# Altium schematic sheet BeaglePhone_Rev1_SCH.SchDoc: Complete Schematic
size 508 x 381 mm; Date: Not shown in title block; ApprovedBy: Not shown in title block; CheckedBy: Not shown in title block; Author: Not shown in title block; CompanyName: Not shown in title block; DrawnBy: Not shown in title block; Engineer: Not shown in title block; Organization: Not shown in title block; Address1: Not shown in title block; Address2: Not shown in title block; Address3: Not shown in title block; Address4: Not shown in title block; DocumentNumber: 1; Revision: Use project parameter SCH_Rev; SheetNumber: 1; SheetTotal: 1; PageSetup: Record=PageOptions|CenterHorizontal=True|CenterVertical=True|PrintScale=0.72|XCorrection=1.00|YCorrection=1.00|PrintKind=0|BorderSize=5000000|LeftOffset=0|BottomOffset=0|Orientation=2|PaperLength=1000|PaperWidth=1000|Scale=100|PaperSource=15|PrintQuality=600|MediaType=1|DitherType=10|PaperKind=Letter|PrintScaleMode=1; CurrentTime: Not shown in title block; CurrentDate: Not shown in title block; Time: Not shown in title block; DocumentFullPathAndName: Not shown in title block; DocumentName: Not shown in title block; ModifiedDate: Not shown in title block; ImagePath: Not shown in title block
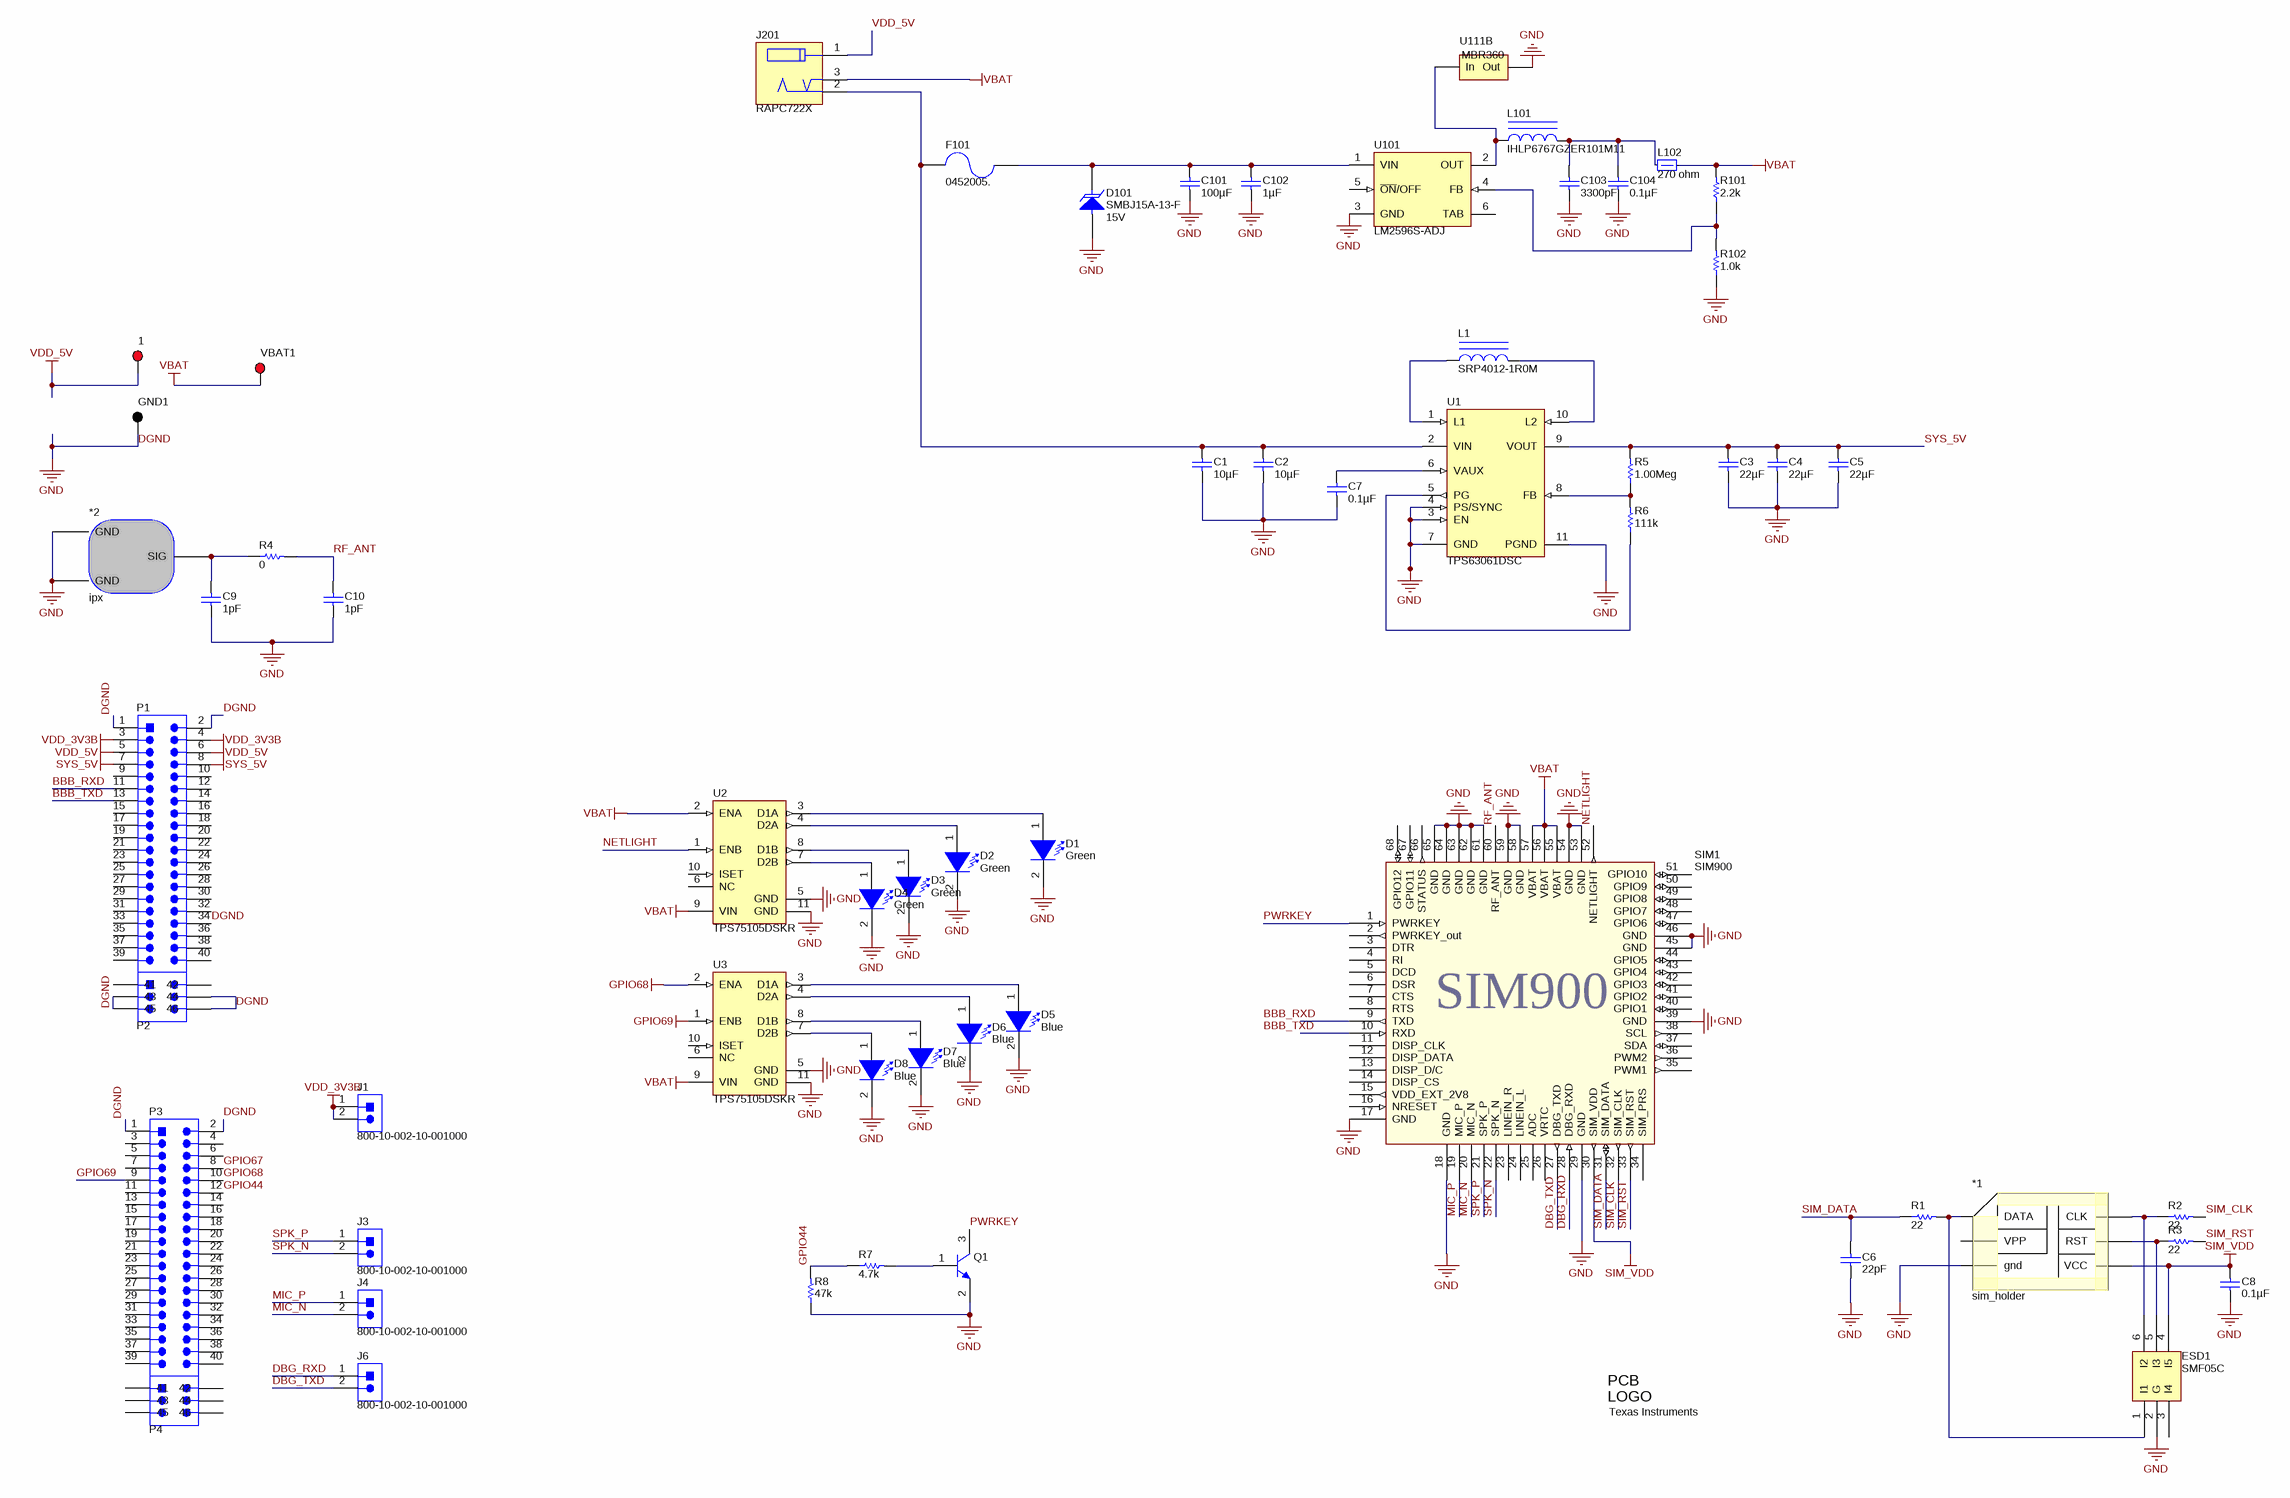
[diagram p0: BeaglePhone_Rev1_SCH.SchDoc]

## Parts
1  5005  [Keystone5005]  (value not drawn)
*1  sim_holder  [SIM_socket]
*2  ipx  [IPX_U.FL]
C1  ValueDisplayed: 10µF  [0603]  (hidden comment: C1608X5R1A106M)
C2  ValueDisplayed: 10µF  [0603]  (hidden comment: C1608X5R1A106M)
C3  ValueDisplayed: 22µF  [0603]  (hidden comment: C1608X5R0G226M080AA)
C4  ValueDisplayed: 22µF  [0603]  (hidden comment: C1608X5R0G226M080AA)
C5  ValueDisplayed: 22µF  [0603]  (hidden comment: C1608X5R0G226M080AA)
C6  ValueDisplayed: 22pF  [0603]  (hidden comment: GRM1885C2A220JA01D)
C7  ValueDisplayed: 0.1µF  [0603]  (hidden comment: C0603X104K3RACTU)
C8  ValueDisplayed: 0.1µF  [0603]  (hidden comment: 06035C104KAT2A)
C9  ValueDisplayed: 1pF  [0603]  (hidden comment: C0603C109C5GACTU)
C10  ValueDisplayed: 1pF  [0603]  (hidden comment: C0603C109C5GACTU)
C101  ValueDisplayed: 100µF  [1206]  (hidden comment: GRM31CR60J107ME39L)
C102  ValueDisplayed: 1µF  [0603]  (hidden comment: GRM188R61A105KA61D)
C103  ValueDisplayed: 3300pF  [0603]  (hidden comment: GRM188R71H332KA01D)
C104  ValueDisplayed: 0.1µF  [0603]  (hidden comment: C0603X104K4RACTU)
D1  value Green  [LG L29K_GREEN]  (hidden comment: LG L29K-G2J1-24-Z)
D2  value Green  [LG L29K_GREEN]  (hidden comment: LG L29K-G2J1-24-Z)
D3  value Green  [LG L29K_GREEN]  (hidden comment: LG L29K-G2J1-24-Z)
D4  value Green  [LG L29K_GREEN]  (hidden comment: LG L29K-G2J1-24-Z)
D5  value Blue  [LB Q39G_BLUE]  (hidden comment: LB Q39G-L2N2-35-1)
D6  value Blue  [LB Q39G_BLUE]  (hidden comment: LB Q39G-L2N2-35-1)
D7  value Blue  [LB Q39G_BLUE]  (hidden comment: LB Q39G-L2N2-35-1)
D8  value Blue  [LB Q39G_BLUE]  (hidden comment: LB Q39G-L2N2-35-1)
D101  SMBJ15A-13-F  value 15V  [SMB]
ESD1  SMF05C  [6pin]
F101  0452005.  [SloBlo452]
GND1  5006  [Keystone5006]  (value not drawn)
J1  800-10-002-10-001000  [Mill-Max_800-10-002-10-001000]
J3  800-10-002-10-001000  [Mill-Max_800-10-002-10-001000]
J4  800-10-002-10-001000  [Mill-Max_800-10-002-10-001000]
J6  800-10-002-10-001000  [Mill-Max_800-10-002-10-001000]
J201  RAPC722X  [CONN_RAPC722X]
L1  SRP4012-1R0M  [SRP4012]
L101  IHLP6767GZER101M11  [IHLP-6767GZ-11]
L102  value 270 ohm  [2220]  (hidden comment: HI2220P271R-10)
Logo1  Texas Instruments  [TI_Symbol_Overlay_Small]  (no BOM)
P1  Comment  [TSW-120-07-G-D]  (value not drawn)
P2  Comment  [SULLINS_PEC03DAAN]  (value not drawn)
P3  Comment  [TSW-120-07-G-D]  (value not drawn)
P4  Comment  [SULLINS_PEC03DAAN]  (value not drawn)
Q1  MMBT2222LT1G  [SOT-23]  (value not drawn)
R1  value 22  [0603]  (hidden comment: CRCW060322R0JNEA)
R2  value 22  [0603]  (hidden comment: CRCW060322R0JNEA)
R3  value 22  [0603]  (hidden comment: CRCW060322R0JNEA)
R4  value 0  [0805_HV]  (hidden comment: CRCW08050000Z0EAHP)
R5  value 1.00Meg  [0603]  (hidden comment: CRCW06031M00FKEA)
R6  value 111k  [0603]  (hidden comment: RT0603BRD07111KL)
R7  ValueDisplayed: 4.7k  [0402]  (hidden comment: CRCW04024K70JNED)
R8  ValueDisplayed: 47k  [0402]  (hidden comment: CRCW04024K70JNED)
R101  value 2.2k  [0603]  (hidden comment: CRCW06032K20JNEA)
R102  value 1.0k  [0603]  (hidden comment: CRCW06031K00JNEA)
SIM1  SIM900  [PCBComponent_1 - duplicate1]
U1  TPS63061DSC  [DSC0010E]
U2  TPS75105DSKR  [DSK0010A]
U3  TPS75105DSKR  [DSK0010A]
U101  LM2596S-ADJ  [TS5B_N]
U111  Used in BOM report  [PCBComponent_1 - duplicate2]  (value not drawn)  (part B of 2)
VBAT1  5005  [Keystone5005]  (value not drawn)

## Nets
DGND: *1.1(gnd) *2.1(GND) *2.2(GND) C1.1 C2.1 C3.1 C4.1 C5.1 C6.2 C7.2 C8.2 C9.2 C10.2 C101.2 C102.2 C103.2 C104.2 D1.2(K) D2.2(K) D3.2(K) D4.2(K) D5.2(K) D6.2(K) D7.2(K) D8.2(K) D101.2(A) ESD1.2(G) GND1.1 P1.1 P1.2 P1.34 P2.3(43) P2.4(44) P2.5(45) P2.6(46) P3.1 P3.2 Q1.2(E) R8.1 R102.1 SIM1.17(GND) SIM1.18(GND) SIM1.29(GND) SIM1.39(GND) SIM1.45(GND) SIM1.46(GND) SIM1.53(GND) SIM1.54(GND) SIM1.58(GND) SIM1.59(GND) SIM1.61(GND) SIM1.62(GND) SIM1.63(GND) SIM1.64(GND) SIM1.65(GND) U1.3(EN) U1.4(PS/SYNC) U1.7(GND) U1.11(PGND) U2.5(GND) U2.11(GND) U3.5(GND) U3.11(GND) U101.3(GND) U111.2(Out)  [also labelled GND]
GPIO68: P3.10 U3.2(ENA)
GPIO69: P3.9 U3.1(ENB)
SIM_VDD: *1.6(VCC) C8.1 ESD1.4(I5) SIM1.30(SIM_VDD)
SYS_5V: C3.2 C4.2 C5.2 P1.7 P1.8 R5.2 U1.9(VOUT)
VBAT: J201.3 L102.2 R101.2 SIM1.55(VBAT) SIM1.56(VBAT) SIM1.57(VBAT) U2.2(ENA) U2.9(VIN) U3.9(VIN) VBAT1.1
VDD_3V3B: J1.1 J1.2 P1.3 P1.4
VDD_5V: 1.1 J201.1 P1.5 P1.6
BBB_RXD: P1.11
BBB_TXD: P1.13
DBG_RXD: J6.1 SIM1.28(DBG_RXD)
DBG_TXD: J6.2 SIM1.27(DBG_TXD)
GPIO44: P3.12 R7.1 R8.2
GPIO67: P3.8
MIC_N: J4.2 SIM1.20(MIC_N)
MIC_P: J4.1 SIM1.19(MIC_P)
NETLIGHT: SIM1.52(NETLIGHT) U2.1(ENB)
PWRKEY: Q1.3(C) SIM1.1(PWRKEY)
RF_ANT: C10.1 R4.2 SIM1.60(RF_ANT)
SIM_CLK: R2.2 SIM1.32(SIM_CLK)
SIM_DATA: C6.1 R1.1 SIM1.31(SIM_DATA)
SIM_RST: R3.2 SIM1.33(SIM_RST)
SPK_N: J3.2 SIM1.22(SPK_N)
SPK_P: J3.1 SIM1.21(SPK_P)
Net*1_3: *1.3(DATA) ESD1.1(I1) R1.2
Net*1_4: *1.4(CLK) ESD1.6(I2) R2.1
Net*1_5: *1.5(RST) ESD1.5(I3) R3.1
Net*2_3: *2.3(SIG) C9.1 R4.1
NetC1_2: C1.2 C2.2 F101.2 J201.2 U1.2(VIN)
NetC7_1: C7.1 U1.6(VAUX)
NetC101_1: C101.1 C102.1 D101.1(K) F101.1 U101.1(VIN)
NetC103_1: C103.1 C104.1 L101.2 L102.1
NetD1_1: D1.1(A) U2.3(D1A)
NetD2_1: D2.1(A) U2.4(D2A)
NetD3_1: D3.1(A) U2.8(D1B)
NetD4_1: D4.1(A) U2.7(D2B)
NetD5_1: D5.1(A) U3.3(D1A)
NetD6_1: D6.1(A) U3.4(D2A)
NetD7_1: D7.1(A) U3.8(D1B)
NetD8_1: D8.1(A) U3.7(D2B)
NetL1_1: L1.1 U1.1(L1)
NetL1_2: L1.2 U1.10(L2)
NetL101_1: L101.1 U101.2(OUT) U111.1(In)
NetQ1_1: Q1.1(B) R7.2
NetR5_1: R5.1 R6.2 U1.8(FB)
NetR6_1: R6.1 U1.5(PG)
NetR101_1: R101.1 R102.2 U101.4(FB)

Not connected (* = marked no-connect by the designer): *1 2(VPP); ESD1 3(I4); P1 9 10 12 14 15 16 17 18 19 20 21 22 23 24 25 26 27 28 29 30 31 32 33 35 36 37 38 39 40; P2 1(41) 2(42); P3 3 4 5 6 7 11 13 14 15 16 17 18 19 20 21 22 23 24 25 26 27 28 29 30 31 32 33 34 35 36 37 38 39 40; P4 1(41) 2(42) 3(43) 4(44) 5(45) 6(46); SIM1 2(PWRKEY_out) 3(DTR) 4(RI) 5(DCD) 6(DSR) 7(CTS) 8(RTS) 9(TXD) 10(RXD) 11(DISP_CLK) 12(DISP_DATA) 13(DISP_D/C) 14(DISP_CS) 15(VDD_EXT_2V8) 16(NRESET) 23(LINEIN_R) 24(LINEIN_L) 25(ADC) 26(VRTC) 34(SIM_PRS) 35(PWM1) 36(PWM2) 37(SDA) 38(SCL) 40(GPIO1) 41(GPIO2) 42(GPIO3) 43(GPIO4) 44(GPIO5) 47(GPIO6) 48(GPIO7) 49(GPIO8) 50(GPIO9) 51(GPIO10) 66(STATUS) 67(GPIO11) 68(GPIO12); U2 6(NC) 10(ISET); U3 6(NC) 10(ISET); U101 5(~{ON}/OFF) 6(TAB)

## Notes on the sheet
- Labels drawn without touching a wire or pin: BBB_RXD, BBB_TXD
- Project:
- Designed for:
- Mod. Date:
- Sheet Title:
- Size:
- File:
- Assembly Variant:
- B
- Schematic:
- 870
- Rev:
- Sheet:
- of
- http://www.ti.com
- Texas Instruments and/or its licensors do not warrant the accuracy or completeness of this specification or any information contained therein. Texas Instruments and/or its licensors do not warrant that this design will meet the specifications, will be suitable for your application or fit for any particular purpose, or will operate in an implementation. Texas Instruments and/or its licensors do not warrant that the design is production worthy. You should completely validate and test your design implementation to confirm the system functionality for your application.
- Contact:
- © Texas Instruments
- (in symbol TI_Logo) PCB; LOGO

## Library data of the parts
1 VBAT1 = 5005: Test Point, TH, Compact, Red; Manufacturer: Keystone; Alternate Manufacturer: Any; Alternate PartNumber: Equivalent; CompType: Test Point Loop; U/M: EA; RoHS: Y; DigiKeyPartNumber: 5005K-ND; Value: Red; SymbolVersion: 2008-04-04; PartNumber: 5005; PackageReference: Keystone5005; ComponentLink1Description: Datasheet Link; ComponentLink1URL: http://www.keyelco.com/pdfs/M55p51.pdf; MountType: TH; Publisher: Texas Instruments; LatestRevisionDate: 2012-07-13; LatestRevisionNote: Changed publisher; Supplier 1: Digi-Key; Supplier Part Number 1: 5005K-ND
C1 C2 = C1608X5R1A106M: CAP, CERM, 10uF, 10V, +/-20%, X5R, 0603; Manufacturer: TDK; Polarized: N; CompType: Capacitor; U/M: EA; Cap_F: 0.00001; Tolerance_%: 20; ESR_Ohm: 0.0078; Value1: 0.0078 ohm; VDC_V: 10; IRMS_A: 1.85; TaMin_C: -55; TaMax_C: 85; SymbolVersion: 2008-07-09; Value: 10uF; PartNumber: C1608X5R1A106M; PackageReference: 0603; RoHS: Y; Value2: 10V; MountType: SMT; Technology: Ceramic; TempCo: X5R; Cap_Case: 0603; Published: 2008-06-19; Publisher: Texas Instruments; LatestRevisionDate: 2014-05-28; ComponentLink1Description: Datasheet link; ComponentLink1URL: http://www.tdk.com/pdf/general_B11.pdf; Supplier 1: Digi-Key; Supplier Part Number 1: 445-6853-1-ND; Supplier 2: Farnell; Supplier Part Number 2: 1962113
C3-C5 = C1608X5R0G226M080AA: CAP, CERM, 22uF, 4V, +/-20%, X5R, 0603; Manufacturer: TDK; Polarized: N; CompType: Capacitor; U/M: EA; Cap_F: 0.000022; Tolerance_%: 20; Value1: Unknown; VDC_V: 4; TaMin_C: -55; TaMax_C: 85; SymbolVersion: 2008-07-09; Value: 22uF; PartNumber: C1608X5R0G226M080AA; PackageReference: 0603; RoHS: Y; Value2: 4V; MountType: SMT; Technology: Ceramic; TempCo: X5R; Cap_Case: 0603; Published: 2008-06-19; Publisher: Texas Instruments; LatestRevisionDate: 2014-05-28; ComponentLink1Description: Datasheet link; ComponentLink1URL: http://www.tdk.com/pdf/TDKMLCCCapRange.pdf; Supplier 1: Digi-Key; Supplier Part Number 1: 445-8030-1-ND
C6 = GRM1885C2A220JA01D: CAP, CERM, 22pF, 100V, +/-5%, C0G/NP0, 0603; Manufacturer: MuRata; Polarized: N; CompType: Capacitor; U/M: EA; Cap_F: 0.000000000022; Tolerance_%: 5; Value1: Unknown; VDC_V: 100; TaMin_C: -55; TaMax_C: 125; SymbolVersion: 2008-07-09; Value: 22pF; PartNumber: GRM1885C2A220JA01D; PackageReference: 0603; RoHS: Y; Value2: 100V; MountType: SMT; Technology: Ceramic; TempCo: C0G/NP0; Cap_Case: 0603; Published: 2008-06-19; Publisher: Texas Instruments; LatestRevisionDate: 2014-05-28; ComponentLink1Description: Datasheet link; ComponentLink1URL: http://search.murata.co.jp/Ceramy/PnsearchViewAction.do?HnOFG=ON&HnNFG=ON&SEL_CNT=50&sLang=en&sKey=GRM1885C2A220JA01D&x=9&y=9&search=startwith; Supplier 1: Digi-Key; Supplier Part Number 1: 490-1335-1-ND; Supplier 2: Mouser; Supplier Part Number 2: 81-GRM1885C2A220JA01
C7 = C0603X104K3RACTU: CAP, CERM, 0.1uF, 25V, +/-10%, X7R, 0603; Manufacturer: Kemet; Polarized: N; CompType: Capacitor; U/M: EA; Cap_F: 0.0000001; Tolerance_%: 10; Value1: Unknown; VDC_V: 25; TaMin_C: -55; TaMax_C: 125; SymbolVersion: 2008-07-09; Value: 0.1uF; PartNumber: C0603X104K3RACTU; PackageReference: 0603; RoHS: Y; Value2: 25V; MountType: SMT; Technology: Ceramic; TempCo: X7R; Cap_Case: 0603; Published: 2008-06-19; Publisher: Texas Instruments; LatestRevisionDate: 2014-05-28; ComponentLink1Description: Datasheet link; ComponentLink1URL: http://www.kemet.com/kemet/web/homepage/kechome.nsf/vapubfiles/F3102_Y5V.pdf/$file/F3102_Y5V.pdf; Supplier 1: Digi-Key; Supplier Part Number 1: 399-5345-1-ND; Supplier 2: Mouser; Supplier Part Number 2: 80-C0603X104K3R; Supplier 3: Farnell; Supplier Part Number 3: 1601773
C8 = 06035C104KAT2A: CAP, CERM, 0.1 µF, 50 V, +/- 10%, X7R, 0603; Manufacturer: AVX; Polarized: N; CompType: Capacitor; Value: 0.1uF; U/M: EA; Cap_F: 0.0000001; Tolerance_%: 10; Value1: Unknown; VDC_V: 50; Value2: 50V; TaMin_C: -55; TaMax_C: 125; SymbolVersion: 2008-07-09; PartNumber: 06035C104KAT2A; PackageReference: 0603; RoHS: Y; MountType: SMT; Technology: Ceramic; TempCo: X7R; Cap_Case: 0603; Published: 2008-06-19; Publisher: Texas Instruments; LatestRevisionDate: 2014-07-21; ComponentLink1Description: Datasheet link; ComponentLink1URL: http://www.avx.com/docs/Catalogs/cx7r.pdf; Supplier 1: Digi-Key; Supplier Part Number 1: 478-5052-1-ND; Supplier 2: Mouser; Supplier Part Number 2: 581-06035C104KAT2A; Supplier 3: Farnell; Supplier Part Number 3: 1301804
C9 C10 = C0603C109C5GACTU: CAP, CERM, 1pF, 50V, +/-25%, C0G/NP0, 0603; Manufacturer: Kemet; Polarized: N; CompType: Capacitor; U/M: EA; Cap_F: 0.000000000001; Tolerance_%: 25; Value1: Unknown; VDC_V: 50; TaMin_C: -55; TaMax_C: 125; SymbolVersion: 2008-07-09; Value: 1pF; PartNumber: C0603C109C5GACTU; PackageReference: 0603; RoHS: Y; Value2: 50V; MountType: SMT; Technology: Ceramic; TempCo: C0G/NP0; Cap_Case: 0603; Published: 2008-06-19; Publisher: Texas Instruments; LatestRevisionDate: 2014-05-28; ComponentLink1Description: Datasheet link; ComponentLink1URL: http://www.kemet.com/kemet/web/homepage/kechome.nsf/vapubfiles/F3102_Y5V.pdf/$file/F3102_Y5V.pdf; Supplier 1: Digi-Key; Supplier Part Number 1: 399-1045-1-ND; Supplier 2: Mouser; Supplier Part Number 2: 80-C0603C109C5G; Supplier 3: Farnell; Supplier Part Number 3: 1414611
C101 = GRM31CR60J107ME39L: CAP, CERM, 100uF, 6.3V, +/-20%, X5R, 1206; Manufacturer: MuRata; Polarized: N; CompType: Capacitor; U/M: EA; Cap_F: 0.0001; Tolerance_%: 20; ESR_Ohm: 0.003; Value1: 0.003 ohm; VDC_V: 6.3; TaMin_C: -55; TaMax_C: 85; SymbolVersion: 2008-07-09; Value: 100uF; PartNumber: GRM31CR60J107ME39L; PackageReference: 1206; RoHS: Y; Value2: 6.3V; MountType: SMT; Technology: Ceramic; TempCo: X5R; Cap_Case: 1206; Published: 2008-06-19; Publisher: Texas Instruments; LatestRevisionDate: 2014-05-28; ComponentLink1Description: Datasheet link; ComponentLink1URL: http://search.murata.co.jp/Ceramy/PnsearchViewAction.do?HnOFG=ON&HnNFG=ON&SEL_CNT=50&sLang=en&sKey=GRM31CR60J107ME39L&x=9&y=9&search=startwith; Supplier 1: Digi-Key; Supplier Part Number 1: 490-4539-1-ND; Supplier 2: Mouser; Supplier Part Number 2: 81-GRM31CR60J107ME9L; Supplier 3: Farnell; Supplier Part Number 3: 1735535
C102 = GRM188R61A105KA61D: CAP, CERM, 1uF, 10V, +/-10%, X5R, 0603; Manufacturer: MuRata; Polarized: N; CompType: Capacitor; U/M: EA; Cap_F: 0.000001; Tolerance_%: 10; Value1: Unknown; TaMin_C: -55; TaMax_C: 85; SymbolVersion: 2008-07-09; Value: 1uF; PartNumber: GRM188R61A105KA61D; PackageReference: 0603; RoHS: Y; VDC_V: 10; Value2: 10V; MountType: SMT; Technology: Ceramic; TempCo: X5R; Cap_Case: 0603; Published: 2008-06-19; Publisher: Texas Instruments; LatestRevisionDate: 2014-05-28; ComponentLink1Description: Datasheet link; ComponentLink1URL: http://search.murata.co.jp/Ceramy/PnsearchViewAction.do?HnOFG=ON&HnNFG=ON&SEL_CNT=50&sLang=en&sKey=GRM188R61A105KA61D&x=9&y=9&search=startwith; Supplier 1: Digi-Key; Supplier Part Number 1: 490-1543-1-ND; Supplier 2: Mouser; Supplier Part Number 2: 81-GRM39R105K10; Supplier 3: Farnell; Supplier Part Number 3: 1828798
C103 = GRM188R71H332KA01D: CAP, CERM, 3300pF, 50V, +/-10%, X7R, 0603; Manufacturer: MuRata; Polarized: N; CompType: Capacitor; U/M: EA; Cap_F: 0.0000000033; Tolerance_%: 10; Value1: Unknown; VDC_V: 50; TaMin_C: -55; TaMax_C: 125; SymbolVersion: 2008-07-09; Value: 3300pF; PartNumber: GRM188R71H332KA01D; PackageReference: 0603; RoHS: Y; Value2: 50V; MountType: SMT; Technology: Ceramic; TempCo: X7R; Cap_Case: 0603; Published: 2008-06-19; Publisher: Texas Instruments; LatestRevisionDate: 2014-05-28; ComponentLink1Description: Datasheet link; ComponentLink1URL: http://search.murata.co.jp/Ceramy/PnsearchViewAction.do?HnOFG=ON&HnNFG=ON&SEL_CNT=50&sLang=en&sKey=GRM188R71H332KA01D&x=9&y=9&search=startwith; Supplier 1: Digi-Key; Supplier Part Number 1: 490-1503-1-ND; Supplier 2: Mouser; Supplier Part Number 2: 81-GRM188R71H332KA; Supplier 3: Farnell; Supplier Part Number 3: 1828914
C104 = C0603X104K4RACTU: CAP, CERM, 0.1uF, 16V, +/-10%, X7R, 0603; Manufacturer: Kemet; Polarized: N; CompType: Capacitor; U/M: EA; Cap_F: 0.0000001; Tolerance_%: 10; Value1: Unknown; VDC_V: 16; TaMin_C: -55; TaMax_C: 125; SymbolVersion: 2008-07-09; Value: 0.1uF; PartNumber: C0603X104K4RACTU; PackageReference: 0603; RoHS: Y; Value2: 16V; MountType: SMT; Technology: Ceramic; TempCo: X7R; Cap_Case: 0603; Published: 2008-06-19; Publisher: Texas Instruments; LatestRevisionDate: 2014-05-28; ComponentLink1Description: Datasheet link; ComponentLink1URL: http://www.kemet.com/kemet/web/homepage/kechome.nsf/vapubfiles/F3102_Y5V.pdf/$file/F3102_Y5V.pdf; Supplier 1: Digi-Key; Supplier Part Number 1: 399-5344-1-ND; Supplier 2: Mouser; Supplier Part Number 2: 80-C0603X104K4R; Supplier 3: Farnell; Supplier Part Number 3: 1414027
D1-D4 = LG L29K-G2J1-24-Z: LED, Green, SMD; Manufacturer: OSRAM; Vf_V: 1.7; Value2: 1.7V; Io_A: 0.002; Tjmax_C: 110; Value1: W; U/M: EA; CompType: LED; PartNumber: LG L29K-G2J1-24-Z; SymbolVersion: 2008-12-08; MountType: SMT; RoHS: Y; PackageReference: 1.7x0.65x0.8mm; Type: ?; Color: green; Published: 2008-07-11; Publisher: Texas Instruments; ComponentLink1URL: http://www.osram-os.com/Graphics/XPic2/00077107_0.pdf; ComponentLink1Description: Datasheet link; LatestRevisionDate: 2014-05-14; Supplier 1: Digi-Key; Supplier Part Number 1: 475-2709-1-ND; Supplier 2: Mouser; Supplier Part Number 2: 720-LGL29KG2J124Z
D5-D8 = LB Q39G-L2N2-35-1: LED, Blue, SMD; Manufacturer: OSRAM; Vf_V: 2.85; Value2: 2.85V; Io_A: 0.15; Tjmax_C: 95; Value1: W; U/M: EA; CompType: LED; PartNumber: LB Q39G-L2N2-35-1; SymbolVersion: 2008-12-08; MountType: SMT; RoHS: Y; PackageReference: BLUE 0603 LED; Type: ?; Color: blue; Published: 2008-07-11; Publisher: Texas Instruments; ComponentLink1URL: http://catalog.osram-os.com/catalogue/catalogue.do;jsessionid=8F4D5D14036503CDC6D844D9AC77EBC1?act=downloadFile&favOid=02000006000372cb000100b6; ComponentLink1Description: Datasheet link; LatestRevisionDate: 2014-05-14; Supplier 1: Digi-Key; Supplier Part Number 1: 475-2816-1-ND; Supplier 2: Mouser; Supplier Part Number 2: 720-LBQ39GL2N2351
D101 = SMBJ15A-13-F: Diode, TVS, Uni, 15V, 600W, SMB; Manufacturer: Diodes Inc.; U/M: EA; Power_W: 5; Vr_V: 15; Value1: 5W; CompType: TVS; SymbolVersion: 2012-01-13; PartNumber: SMBJ15A-13-F; PackageReference: SMB; Vz_V: N/A; MountType: SMT; RoHS: Y; ComponentLink1Description: Datasheet link; ComponentLink1URL: http://www.diodes.com/datasheets/ds19002.pdf; Published: 2008-10-08; Publisher: Texas Instruments; LatestRevisionDate: 2014-06-04; LatestRevisionNote: Updated Supplier Data; Supplier 1: Digi-Key; Supplier Part Number 1: SMBJ15A-FDICT-ND; Supplier 2: Mouser; Supplier Part Number 2: 621-SMBJ15A-13-F
F101 = 0452005.: Fuse, 5A, 125V, SMD; Manufacturer: Littelfuse; U/M: EA; OpeningTime_100%_min: 4; OpeningTime_200%_max: 60; VDC_V: 125; Interrupt_DC: 50; Irating_A: 5; Rtyp_Ohm: 0.0136; MeltingTyp: 53.72; Soldering_Wave_MaxTemp_C: 260; Soldering_Wave_MaxTime_s: 3; Soldering_Reflow_MaxTemp_C: 250; Soldering_Reflow_MaxTime_s: 40; SymbolVersion: 2008-07-09; PartNumber: 0452005.; PackageReference: SloBlo452; CompType: Fuse; Published: 2009-03-05; RoHS: Y; VAC_V: 125; Interrupt_AC: 50; Publisher: Texas Instruments; LatestRevisionDate: 2014-04-17; ComponentLink1Description: Datasheet link; ComponentLink1URL: http://www.littelfuse.com/data/en/Data_Sheets/Littelfuse_Fuse_452_454_Series.pdf; MountType: SMT; Supplier 1: Digi-Key; Supplier Part Number 1: F2607CT-ND
GND1 = 5006: Test Point, TH, Compact, Black; Manufacturer: Keystone; Alternate Manufacturer: Any; Alternate PartNumber: Equivalent; CompType: Test Point Loop; U/M: EA; RoHS: Y; DigiKeyPartNumber: 5006K-ND; Value: Black; SymbolVersion: 2008-04-04; PartNumber: 5006; PackageReference: Keystone5006; ComponentLink1Description: Datasheet Link; ComponentLink1URL: http://www.keyelco.com/pdfs/M55p51.pdf; MountType: TH; Publisher: Texas Instruments; LatestRevisionDate: 2012-07-13; LatestRevisionNote: Changed publisher; Supplier 1: Digi-Key; Supplier Part Number 1: 5006K-ND
J1 J3 J4 J6 = 800-10-002-10-001000: Header, 2x1, 100mil, SMT; Manufacturer: Mill-Max; SymbolCreator: a0412235; U/M: EA; SymbolVersion: 2013-10-31; PartNumber: 800-10-002-10-001000; PackageReference: Header, 2x1, 100mil, TH; CompType: Header; RoHS: Y; MountType: TH; ComponentLink1Description: Datasheet Link; ComponentLink1URL: http://www.mill-max.com/assets/pdfs/054.PDF; Publisher: Texas Instruments; LatestRevisionDate: 2014-07-21; Supplier 1: Digi-Key; Supplier Part Number 1: ED7202-ND
J201 = RAPC722X: Power Jack, mini, 2.1mm OD, R/A, TH; Manufacturer: Switchcraft; SymbolCreator: a0799628; U/M: EA; SymbolVersion: 2013-07-18; PartNumber: RAPC722X; PackageReference: Jack, 14.5x11x9mm; CompType: Power Jack; RoHS: Y; MountType: TH; ComponentLink1Description: Datasheet Link; ComponentLink1URL: http://www.switchcraft.com/Drawings/rapc722x_cd.pdf; Publisher: Texas Instruments; LatestRevisionDate: 2014-06-05; Supplier 1: Digi-Key; Supplier Part Number 1: SC1313-ND; Supplier 2: Mouser; Supplier Part Number 2: 502-RAPC722X; Supplier 3: Farnell; Supplier Part Number 3: 1608727
L1 = SRP4012-1R0M: Inductor, Flat Wire, Powdered Iron, 1uH, 4.8A, 0.0336 ohm, SMD; Manufacturer: Bourns; Ind_H: 1.0E-6; ValueDisplayed: 1µH; Imax_A: 4.8; Irms: 4.8A @ 40C rise; Isat: 6.3A @ 20% inductance drop; DCR_ohm: 0.0336; SymbolVersion: 2008-07-23; CompType: Inductor; Value: 1uH; PartNumber: SRP4012-1R0M; Value1: 0.0336 ohm; Value2: 4.8A; Technology: Flat Wire; MountType: SMT; Material: Powdered Iron; PackageReference: 4.7x1.2x4.0mm; Published: 2008-06-26; Publisher: Texas Instruments; LatestRevisionDate: 2014-07-22; ComponentLink1Description: Datasheet link; ComponentLink1URL: http://www.bourns.com/data/global/pdfs/SRP4012.pdf; RoHS: Y; Supplier 1: Digi-Key; Supplier Part Number 1: SRP4012-1R0MCT-ND; Supplier 2: Mouser; Supplier Part Number 2: 652-SRP4012-1R0M; Supplier 3: Farnell; Supplier Part Number 3: 2093929
L101 = IHLP6767GZER101M11: Inductor, Shielded, Powdered Iron, 100uH, 4A, 0.11 ohm, SMD; Manufacturer: Vishay-Dale; Ind_H: 100.0E-6; ValueDisplayed: 100µH; Imax_A: 4; Irms: 5A @ 40C rise; Isat: 4A @ 20% inductance drop; DCR_ohm: 0.11; SymbolVersion: 2008-07-23; CompType: Inductor; Value: 100uH; PartNumber: IHLP6767GZER101M11; Value1: 0.11 ohm; Value2: 4A; Technology: Shielded; MountType: SMT; Material: Powdered Iron; PackageReference: 17.15x7.0x17.15mm; Published: 2008-06-26; Publisher: Texas Instruments; LatestRevisionDate: 2014-05-27; ComponentLink1Description: Datasheet link; ComponentLink1URL: http://www.vishay.com/docs/34306/lp67dz11.pdf; RoHS: Y; Supplier 1: Digi-Key; Supplier Part Number 1: 541-1294-1-ND
L102 = HI2220P271R-10: Ferrite Bead, 270 ohm @ 100MHz, 4A, 2220; Manufacturer: Laird-Signal Integrity Products; Imax_A: 4; DCR_ohm: 0.035; Value1: 0.035 ohm; ZTyp@100MHz_Ohm: 270; Ztyp@1GHz_Ohm: 250; CompType: Ferrite Bead; SymbolVersion: 2009-06-02; PartNumber: HI2220P271R-10; Value2: 4A; MountType: SMT; PackageReference: 2220; Published: 2014-04-30; Publisher: Texas Instruments; LatestRevisionDate: 2014-04-30; ComponentLink1Description: Datasheet link; ComponentLink1URL: http://www.lairdtech.com/DownloadAsset.aspx?id=4858; RoHS: Y
Logo1 = TI_Logo: Texas Instrument Corporate Signature; SymbolCreator: codlsc; SymbolVersion: 2011-08-22; ClassName: Logo; Published: 2009-03-03; Publisher: Texas Instruments; LatestRevisionDate: 2012-05-17; LatestRevisionNote: Changed publisher
P1 P3 = TSW-120-07-G-D: Header, 100mil, 20x2, Gold, TH; Manufacturer: Samtec; SymbolCreator: a0412235; U/M: EA; SymbolVersion: 2013-10-14; PartNumber: TSW-120-07-G-D; ClassName: Header; PackageReference: 20x2 Header; CompType: Header; RoHS: Y; MountType: TH; ComponentLink1Description: Datasheet Link; ComponentLink1URL: http://samtec.com/ftppub/pdf/TSW_TH.PDF; Publisher: Texas Instruments; LatestRevisionDate: 2014-06-17; Supplier 1: Digi-Key; Supplier Part Number 1: SAM1028-20-ND
P2 P4 = PEC03DAAN: Header, 100mil, 3x2, Tin, TH; Manufacturer: Sullins Connector Solutions; SymbolCreator: a0412235; U/M: EA; SymbolVersion: 2013-10-14; PartNumber: PEC03DAAN; ClassName: Header; PackageReference: 3x2 Header; CompType: Header; RoHS: Y; MountType: TH; ComponentLink1Description: Datasheet Link; ComponentLink1URL: http://www.sullinscorp.com/catalogs/97_Page78-79_HEADER_.100_2.54mm_MALE_BREAKAWAY.pdf; Publisher: Texas Instruments; LatestRevisionDate: 2014-06-17; Supplier 1: Digi-Key; Supplier Part Number 1: S2012E-03-ND
Q1 = MMBT2222LT1G, ON Semiconductor: Transistor, NPN, 30V, 0.6A, SOT-23; CompType: BJT; PNP: 0; NPN: 1; Vceo_V: 30; Vcesat1_V: 2.6; Value: 2.6V; IcRated_A: 0.6; HfeMax: 300; TaMin_C: -55; TaMax_C: 150; U/M: EA; SymbolVersion: 2008-07-31; PartNumber: MMBT2222LT1G; Manufacturer: ON Semiconductor; PackageReference: SOT-23; RoHS: Y; Value1: 0.6A; Value2: 300; Published: 2008-07-31; LatestRevisionDate: 2014-06-03; Publisher: Texas Instruments; ComponentLink1Description: Datasheet link; ComponentLink1URL: http://www.onsemi.com/pub_link/Collateral/MMBT2222LT1-D.PDF; Supplier 1: Digi-Key; Supplier Part Number 1: MMBT2222LT1GOSCT-ND; Supplier 2: Mouser; Supplier Part Number 2: 863-MMBT2222LT1G; Supplier 3: Farnell; Supplier Part Number 3: 1653622; MountType: SMT
R1-R3 = CRCW060322R0JNEA: RES, 22 ohm, 5%, 0.1W, 0603; Manufacturer: Vishay-Dale; CompType: Resistor; Value_Code: 22R0; Tolerance_%: 5; Power_W: 0.1; VDC_V: 75; TempCo: 200 ppm/C; EIA_Code: E24; U/M: EA; SymbolVersion: 2009-05-29; PartNumber: CRCW060322R0JNEA; PackageReference: 0603; RoHS: Y; Res_ohm: 22; Value1: 5%; Value2: 0.1W; MountType: SMT; Technology: Thick Film; Published: 2008-06-26; Publisher: Texas Instruments; LatestRevisionDate: 2014-05-20; ComponentLink1Description: Datasheet link; ComponentLink1URL: http://www.vishay.com/docs/20035/dcrcwe3.pdf; Supplier 1: Digi-Key; Supplier Part Number 1: 541-22GCT-ND; Supplier 2: Mouser; Supplier Part Number 2: 71-CRCW0603J-22-E3; Supplier 3: Farnell; Supplier Part Number 3: 1692521
R4 = CRCW08050000Z0EAHP: RES, 0 ohm, 5%, 0.333W, 0805; Manufacturer: Vishay-Dale; CompType: Resistor; Value_Code: 0000; Tolerance_%: 5; Power_W: 0.333; TempCo: 200 ppm/C; EIA_Code: E24; U/M: EA; SymbolVersion: 2009-05-29; PartNumber: CRCW08050000Z0EAHP; PackageReference: 0805; RoHS: Y; Res_ohm: 0; Value1: 5%; Value2: 0.333W; MountType: SMT; Technology: Thick Film; Published: 2008-06-26; Publisher: Texas Instruments; LatestRevisionDate: 2014-04-18; ComponentLink1Description: Datasheet link; ComponentLink1URL: http://www.vishay.com/docs/20043/crcwhpe3.pdf; Supplier 1: Digi-Key; Supplier Part Number 1: 541-0.0TBCT-ND; Supplier 2: Mouser; Supplier Part Number 2: 71-CRCW08050000Z0EAH; Supplier 3: Farnell; Supplier Part Number 3: 1798268
R5 = CRCW06031M00FKEA: RES, 1.00Meg ohm, 1%, 0.1W, 0603; Manufacturer: Vishay-Dale; CompType: Resistor; Res_ohm: 1000000; Value_Code: 1M00; Tolerance_%: 1; Power_W: 0.1; VDC_V: 75; TempCo: 100 ppm/C; EIA_Code: E96; U/M: EA; SymbolVersion: 2009-05-29; PartNumber: CRCW06031M00FKEA; PackageReference: 0603; RoHS: Y; Value1: 1%; Value2: 0.1W; MountType: SMT; Technology: Thick Film; Published: 2008-06-26; Publisher: Texas Instruments; LatestRevisionDate: 2014-05-20; ComponentLink1Description: Datasheet link; ComponentLink1URL: http://www.vishay.com/docs/20035/dcrcwe3.pdf; Supplier 1: Digi-Key; Supplier Part Number 1: 541-1.00MHCT-ND; Supplier 2: Mouser; Supplier Part Number 2: 71-CRCW0603-1.0M-E3; Supplier 3: Farnell; Supplier Part Number 3: 1469746
R6 = RT0603BRD07111KL: RES, 111k ohm, 0.1%, 0.1W, 0603; Manufacturer: Yageo America; CompType: Resistor; Res_ohm: 111000; Tolerance_%: 0.1; VDC_V: 75; TempCo: 25 ppm/C; EIA_Code: E192; U/M: EA; SymbolVersion: 2009-05-29; PartNumber: RT0603BRD07111KL; PackageReference: 0603; RoHS: Y; Value_Code: 111k; Value1: 0.1%; Power_W: 0.1; Value2: 0.1W; MountType: SMT; Technology: Thin Film; Published: 2008-06-26; Publisher: Texas Instruments; LatestRevisionDate: 2014-05-20; ComponentLink1Description: Datasheet link; ComponentLink1URL: http://www.yageo.com/pdf/PYu-RT_1-to-0.05_RoHS_L_3.pdf
R7 R8 = CRCW04024K70JNED: RES, 4.7 k, 5%, 0.063 W, 0402; Manufacturer: Vishay-Dale; CompType: Resistor; Res_ohm: 4700; Value: 4.7k; Value_Code: 4k70; Tolerance_%: 5; Power_W: 0.063; Value2: 0.063W; VDC_V: 50; TempCo: 200 ppm/C; EIA_Code: E24; U/M: EA; SymbolVersion: 2009-05-29; PartNumber: CRCW04024K70JNED; PackageReference: 0402; RoHS: Y; Value1: 5%; MountType: SMT; Technology: Thick Film; Published: 2008-06-26; Publisher: Texas Instruments; LatestRevisionDate: 2014-07-21; ComponentLink1Description: Datasheet link; ComponentLink1URL: http://www.vishay.com/docs/20035/dcrcwe3.pdf; Supplier 1: Digi-Key; Supplier Part Number 1: 541-4.7KJCT-ND; Supplier 2: Farnell; Supplier Part Number 2: 1514704; Supplier 3: Newark; Supplier Part Number 3: 59M6733
R101 = CRCW06032K20JNEA: RES, 2.2k ohm, 5%, 0.1W, 0603; Manufacturer: Vishay-Dale; CompType: Resistor; Res_ohm: 2200; Value_Code: 2k20; Tolerance_%: 5; Power_W: 0.1; VDC_V: 75; TempCo: 200 ppm/C; EIA_Code: E24; U/M: EA; SymbolVersion: 2009-05-29; PartNumber: CRCW06032K20JNEA; PackageReference: 0603; RoHS: Y; Value1: 5%; Value2: 0.1W; MountType: SMT; Technology: Thick Film; Published: 2008-06-26; Publisher: Texas Instruments; LatestRevisionDate: 2014-05-20; ComponentLink1Description: Datasheet link; ComponentLink1URL: http://www.vishay.com/docs/20035/dcrcwe3.pdf; Supplier 1: Digi-Key; Supplier Part Number 1: 541-2.2KGCT-ND; Supplier 2: Farnell; Supplier Part Number 2: 1652868; Supplier 3: Newark; Supplier Part Number 3: 59M6776
R102 = CRCW06031K00JNEA: RES, 1.0k ohm, 5%, 0.1W, 0603; Manufacturer: Vishay-Dale; CompType: Resistor; Res_ohm: 1000; Value_Code: 1k00; Tolerance_%: 5; Power_W: 0.1; VDC_V: 75; TempCo: 200 ppm/C; EIA_Code: E24; U/M: EA; SymbolVersion: 2009-05-29; PartNumber: CRCW06031K00JNEA; PackageReference: 0603; RoHS: Y; Value1: 5%; Value2: 0.1W; MountType: SMT; Technology: Thick Film; Published: 2008-06-26; Publisher: Texas Instruments; LatestRevisionDate: 2014-05-20; ComponentLink1Description: Datasheet link; ComponentLink1URL: http://www.vishay.com/docs/20035/dcrcwe3.pdf; Supplier 1: Mouser; Supplier Part Number 1: 71-CRCW0603J-1.0K-E3; Supplier 2: Farnell; Supplier Part Number 2: 1652851; Supplier 3: Newark; Supplier Part Number 3: 59M6750
U1 = TPS63061DSC: HIGH INPUT VOLTAGE BUCK-BOOST CONVERTER WITH 2A SWITCH CURRENT, DSC0010E; Alternate Manufacturer: None; Manufacturer: Texas Instruments; SymbolCreator: a0411947; CompType: IC; U/M: EA; SymbolVersion: 2013-03-13; PartNumber: TPS63061DSC; PackageReference: DSC0010E; MountType: SMT; ComponentLink1Description: Datasheet Link; ComponentLink1URL: http://www.ti.com/lit/ds/symlink/tps63061.pdf; RoHS: Y; Publisher: Texas Instruments; LatestRevisionDate: 2014-07-22
U2 U3 = TPS75105DSKR: Low Dropout, Two-Bank LED Driver with PWM Brightness Control, 2.7 to 5.5 V, -40 to 85 degC, 10-pin SON (DSK10), Green (RoHS & no Sb/Br); Manufacturer: Texas Instruments; Alternate Manufacturer: None; Alternate PartNumber: Equivalent; Dimming: TRUE; Iout(Max)(A): 0.025; Iq(Typ)(mA): 0.18; SubFamily: White LED Driver; Topology: LDO; Vin(Max)(V): 5.5; Vin(Min)(V): 2.7; DatasheetVersion: SBVS080H; PackageVersion: 4208566/A; PackageReference: DSK0010A; PackageDescription: 10-Pin Plastic Small Outline, Body 2.5 x 2.5 mm, 0.5 mm Pitch; Supplier 1: Digi-Key; Supplier Part Number 1: TPS75105DSKR-ND; Supplier 2: Mouser; Supplier Part Number 2: 595-TPS75105DSKR; Eco-Plan: Green (RoHS & no Sb/Br); MountType: SMT; PartNumber: TPS75105DSKR; ComponentLink1Description: Manufacturer URL; ComponentLink1URL: http://www.ti.com/; ComponentLink2Description: Datasheet; ComponentLink2URL: http://www.ti.com/general/docs/lit/getliterature.tsp?genericPartNumber=TPS75105&fileType=pdf; ComponentLink3Description: Package Specification; ComponentLink3URL: http://www.ti.com/lit/ml/mpds326/mpds326.pdf
U101 = LM2596S-ADJ: SIMPLE SWITCHER® Power Converter 150 KHz 3A Step-Down Voltage Regulator, 5-pin TO-263; Manufacturer: National Semiconductor; PackageTopMarking: NSUZXYTTE#*LM2596S*-ADJ P+; PowerWise: N; Published: 4-Dec-2008; DatasheetVersion: May-2002; PackageVersion: revD, Apr-2005; PackageReference: TS5B; Publisher: Altium Limited; PackageDescription: TO-263, Molded, .400 x .390 x .180in, 5 Lead, .067in Pitch, Surface Mount; Supplier 1: Farnell; Supplier Part Number 1: 1523864; Supplier 2: Farnell; Supplier Part Number 2: 9494367; PartNumber: LM2596S-ADJ; RoHS: N; PinCount: 5; CompType: Switcher; Code_JEDEC: MO-169-AB; ComponentLink1Description: LM2596 Datasheet; ComponentLink1URL: http://www.national.com/ds/LM/LM2596.pdf; ComponentLink2Description: LM2596 Web Page; ComponentLink2URL: http://www.national.com/pf/LM/LM2596.html; ComponentLink3Description: TS5B Package Page; ComponentLink3URL: http://www.national.com/packaging/folders/ts5b.html
U111 = MBR360: SymbolVersion: use current date i.e. 2008-05-20; SymbolCreator: Use a-id; CompType: Used in some BOM reports.  Useful for finding later.; U/M: EA, IN, or GM; Manufacturer: Used in BOM report; MountType: SMT, TH, or N/A; RoHS: Used in BOM report.  Use Y or N.; PartNumber: Used in BOM report; PackageReference: eg:  0603, used in PnP report; ComponentLink1Description: Datasheet Link; Alternate PartNumber: -; Alternate Manufacturer: -